# EAGLE design THB6064 (EAGLE 6.3)
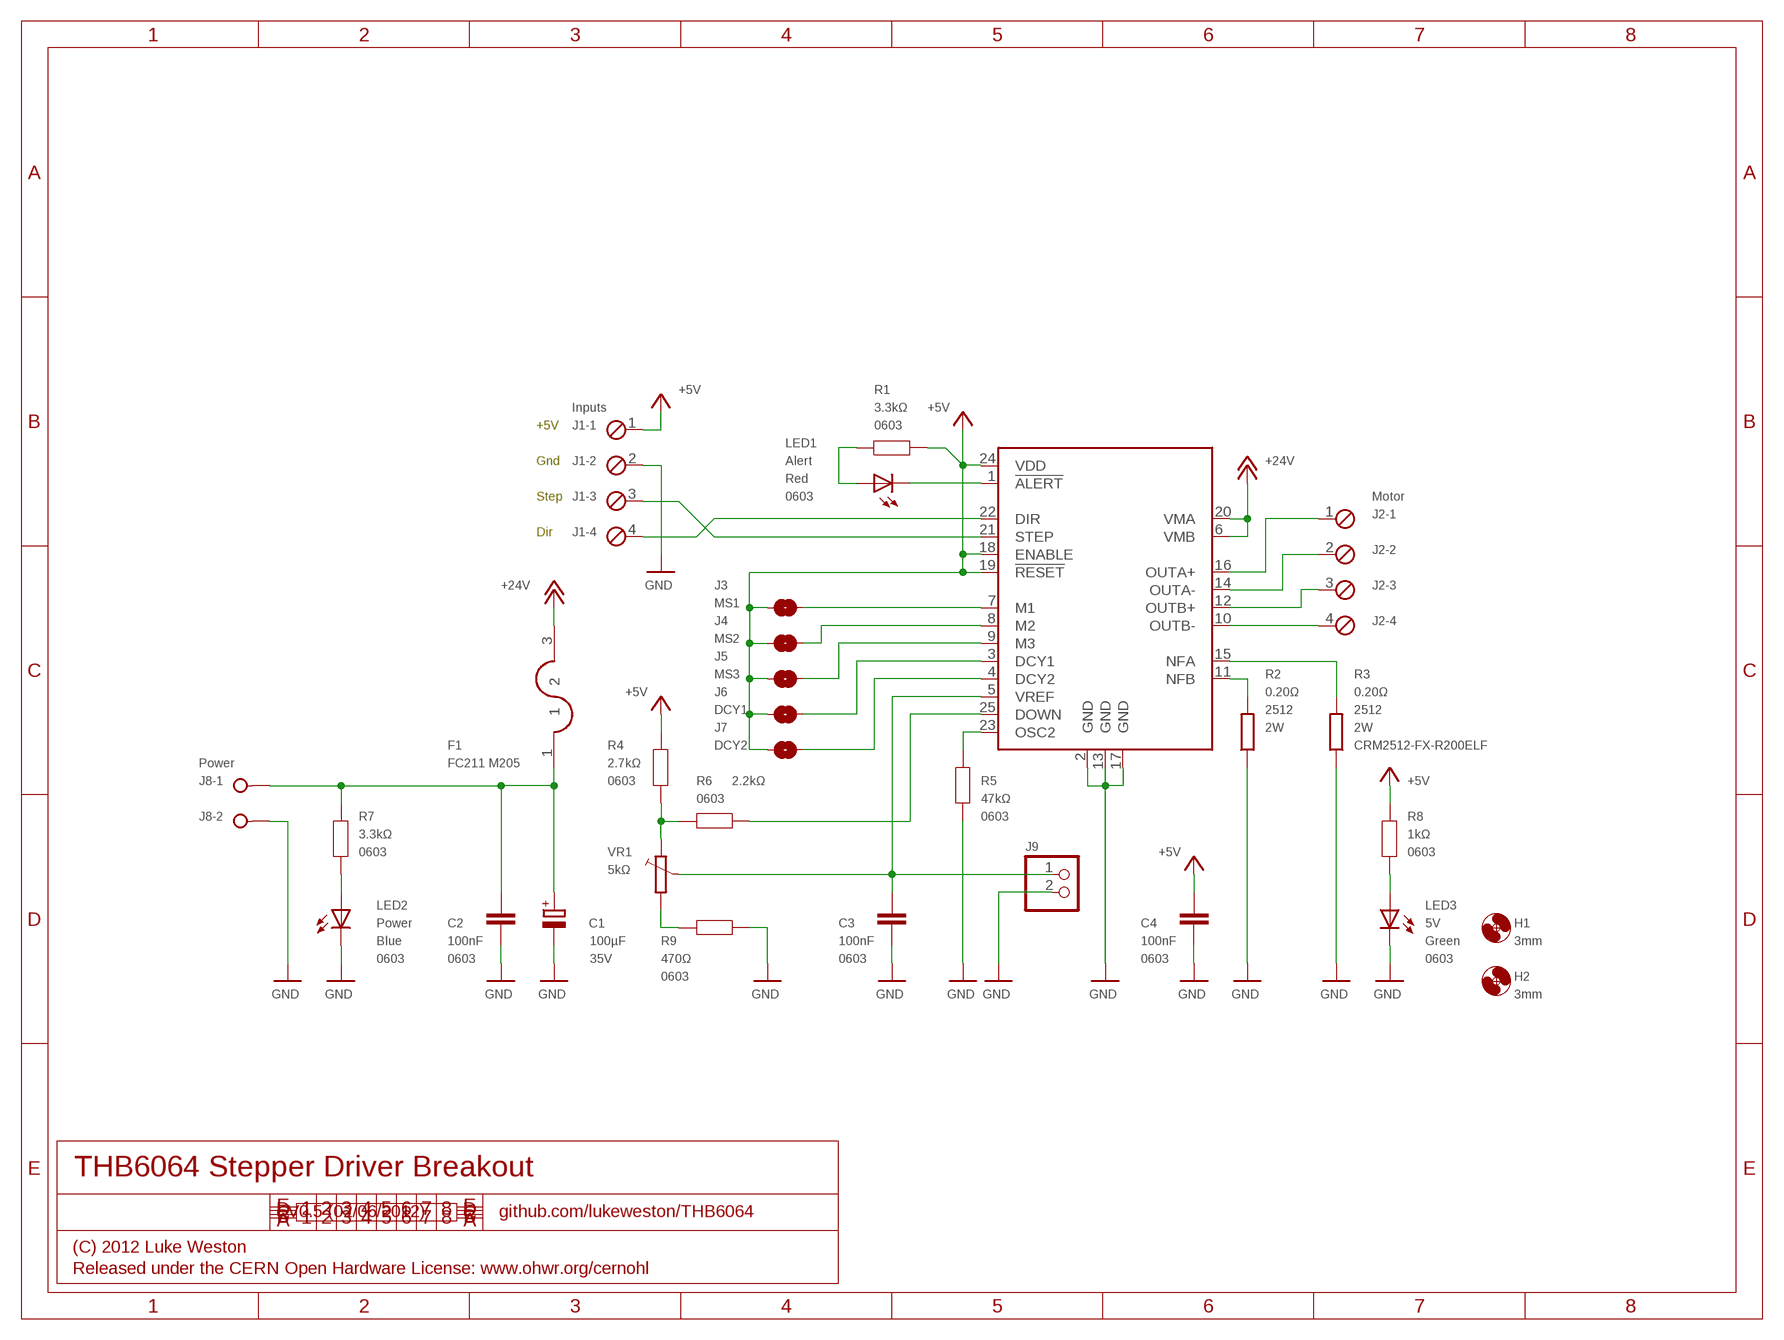
[diagram p0: schematic, sheet 1]

## Parts
C1  100µF  CPOL-EUE3.5-8  [E3,5-8]
C2  100nF  CAP0603  [0603]
C3  100nF  CAP0603  [0603]
C4  100nF  CAP0603  [0603]
F1  FC211 M205  FUSEX20MM  [FUSE_5MM]
H1  3mm  MOUNT-HOLE3.0  [3,0]
H2  3mm  MOUNT-HOLE3.0  [3,0]
IC1  THB6064  [ZIP25]
J1  Inputs  MPT4  [4POL254]
J2  Motor  MPT4  [4POL254]
J3  MS1  SJ  [SJ]
J4  MS2  SJ  [SJ]
J5  MS3  SJ  [SJ]
J6  DCY1  SJ  [SJ]
J7  DCY2  SJ  [SJ]
J8  Power  W237-02P  [W237-132]
J9  PINHD-1X2  [1X02]
LED1  Alert  LED0603  [LED-0603]
LED2  Power  LED0603  [LED-0603]
LED3  5V  LED0603  [LED-0603]
R1  3.3kΩ  RESISTOR0603  [0603]
R2  0.20Ω  R-EU_R2512  [R2512]
R3  0.20Ω  R-EU_R2512  [R2512]
R4  2.7kΩ  RESISTOR0603  [0603]
R5  47kΩ  RESISTOR0603  [0603]
R6  2.2kΩ  RESISTOR0603  [0603]
R7  3.3kΩ  RESISTOR0603  [0603]
R8  1kΩ  RESISTOR0603  [0603]
R9  470Ω  RESISTOR0603  [0603]
VR1  5kΩ  TRIM_EU-CT6  [CT6]

## Nets
+5V: C4.1 IC1.18(ENABLE) IC1.19(!RESET) IC1.24(VDD) J1.1 J3.1 J4.1 J5.1 J6.1 J7.1 R1.2 R4.2 R8.2
+12V: F1.3 IC1.6(VMB) IC1.20(VMA) ; supply symbol labelled +24V
DIR: IC1.22(DIR) J1.4
GND: C1.- C2.2 C3.2 C4.2 IC1.2(GND) IC1.13(GND) IC1.17(GND) J1.2 J8.2 J9.2 LED2.C LED3.C R2.1 R3.1 R5.1 R9.1
MA+: IC1.16(OUTA+) J2.1
MA-: IC1.14(OUTA-) J2.2
MB+: IC1.12(OUTB+) J2.3
MB-: IC1.10(OUTB-) J2.4
N$1: LED2.A R7.1
N$4: LED3.A R8.1
N$5: C1.+ C2.1 F1.1 J8.1 R7.2
N$99: C3.1 IC1.5(VREF) J9.1 VR1.S
N$100: IC1.25(DOWN) R6.1
N$101: R4.1 R6.2 VR1.E
N$102: IC1.1(!ALERT) LED1.C
N$103: LED1.A R1.1
N$104: R9.2 VR1.A
N$105: IC1.23(OSC2) R5.2
N$106: IC1.11(NFB) R2.2
N$107: IC1.15(NFA) R3.2
N$114: IC1.4(DCY2) J7.2
N$115: IC1.3(DCY1) J6.2
N$116: IC1.9(M3) J5.2
N$117: IC1.8(M2) J4.2
N$118: IC1.7(M1) J3.2
STEP: IC1.21(STEP) J1.3

## Notes on the sheet
- +5V
- Gnd
- Step
- Dir
- THB6064 Stepper Driver Breakout
- V0.5 (02/06/2012) | github.com/lukeweston/THB6064
- (C) 2012 Luke Weston
- Released under the CERN Open Hardware License: www.ohwr.org/cernohl

## Library data of the parts
C1 = rcl:CPOL-EU: POLARIZED CAPACITOR, European symbol; VOLTAGE: 35V
C2-C4 = freetronics-master-v1:CAP: Capacitor Standard 0603 ceramic capacitor, and 0.1" leaded capacitor.; PACKAGE: 0603
F1 = SparkFun:FUSE
H1 H2 = holes:MOUNT-HOLE: MOUNTING HOLE with drill center marker
IC1 = tb6560:THB6064: THB6064 Bipolar Stepper Driver IC
J1 J2 = con-phoenix-254:MPT4: PHOENIX CONNECTOR; OC_FARNELL: unknown; OC_NEWARK: unknown
J3-J7 = freetronics-luke:SJ: PCB "solder jumper". Note that there should nothing on the BOM corresponding to this "component".
J8 = con-wago-508:W237-02P: WAGO SREW CLAMP; OC_FARNELL: unknown; OC_NEWARK: unknown
J9 = pinhead:PINHD-1X2: PIN HEADER
LED1 = freetronics-master-v1:LED: LEDs Standard schematic elements and footprints for 5mm, 3mm, 1206, and 0603 sized LEDs. 5mm - Spark Fun Electronics SKU : COM-00529 (and others); COLOR: Red; PACKAGE: 0603
LED2 = freetronics-master-v1:LED: LEDs Standard schematic elements and footprints for 5mm, 3mm, 1206, and 0603 sized LEDs. 5mm - Spark Fun Electronics SKU : COM-00529 (and others); COLOR: Blue; PACKAGE: 0603
LED3 = freetronics-master-v1:LED: LEDs Standard schematic elements and footprints for 5mm, 3mm, 1206, and 0603 sized LEDs. 5mm - Spark Fun Electronics SKU : COM-00529 (and others); COLOR: Green; PACKAGE: 0603
R1 R4-R9 = freetronics-master-v1:RESISTOR: Resistor Basic schematic elements and footprints for 0603, 1206, and PTH 1/10th watt (small) resistors.; PACKAGE: 0603
R2 = rcl:R-EU_: RESISTOR, European symbol; PACKAGE: 2512; POWER: 2W
R3 = rcl:R-EU_: RESISTOR, European symbol; PACKAGE: 2512; POWER: 2W; SKU: CRM2512-FX-R200ELF
VR1 = pot:TRIM_EU-: POTENTIOMETER

## Board
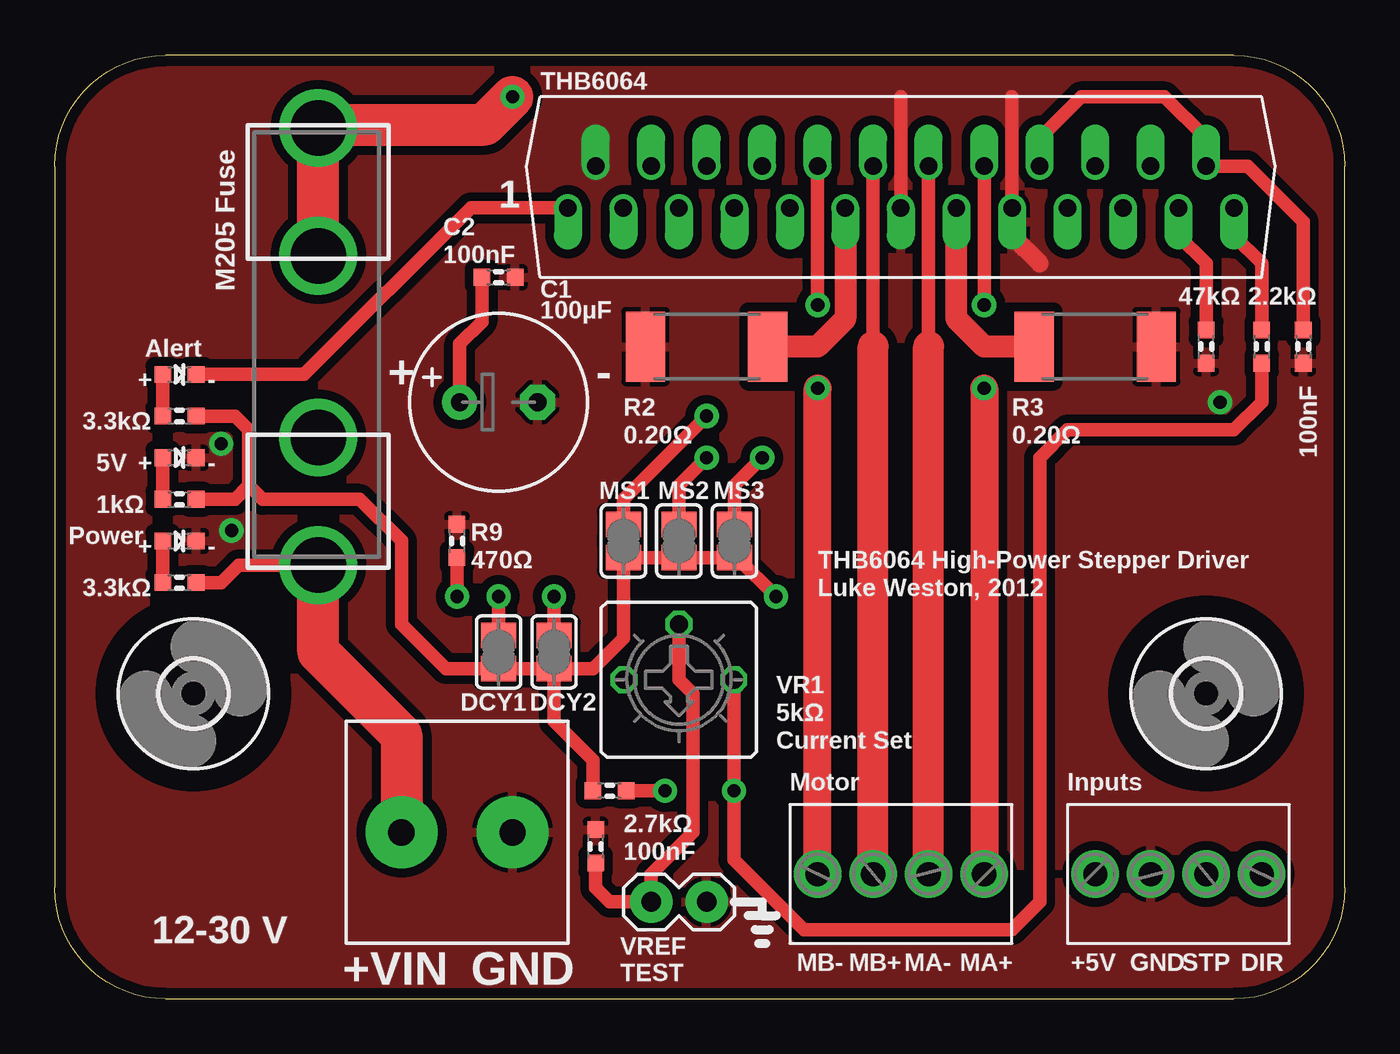
[diagram p1: board, top side]
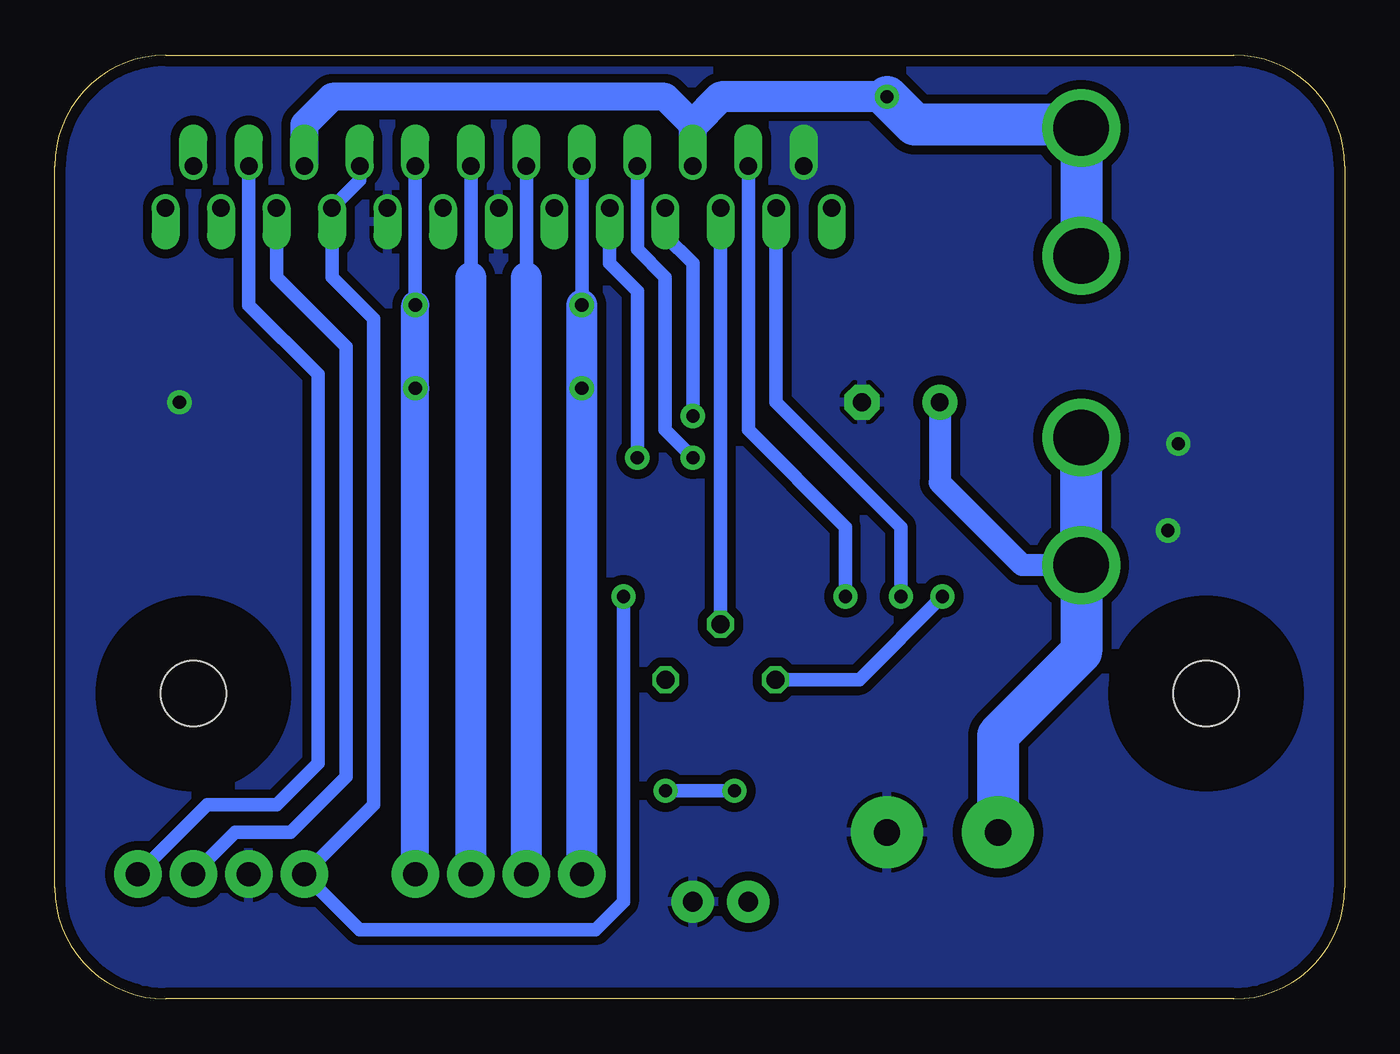
[diagram p2: board, bottom side, seen from below]

Size 59.05 x 43.18 mm. Coordinates in mm from the lower left corner, seen from the top.
Outline: 5.08,0 53.97,0 arc90 59.05,5.08 59.05,38.1 arc90 53.97,43.18 5.08,43.18 arc90 0,38.1 0,5.08 arc90 5.08,0
Copper layers (1*16): Top 0.035mm / dielectric 1.5mm / Bottom 0.035mm
Design rules "PCBCart-Standard": minimum track width 8mil, minimum drill 0.4mm, track to track 8mil, track to pad 8mil, pad to pad 8mil, via to via 8mil, smd to smd 8mil, copper to edge 20mil, drill to drill 8mil, minimum pad ring 8mil, minimum via ring 10mil, stop-mask expansion 3mil, vias tented up to drill 0mil, thermal gap 8mil

### Footprints (pad centres in the part's own frame; a part is rotated, then mirrored left to right if it is on the bottom)
E3,5-8 = drill 0.813 pad 1.6: + -1.778,0 | drill 0.813 pad 1.6 octagon: - 1.778,0
0603 = smd 0.762 x 0.762: 1 -0.762,0; 2 0.762,0
FUSE_5MM = drill 2.54 pad 3.556: 1 0,-10; 2 0,-4.158; 3 0,4.158; 4 0,10
3,0 = hole 3: 0,0
ZIP25 = drill 0.8 pad 1.27 offset: 1 -15.24,0; 2 -13.97,1.905; 3 -12.7,0; 4 -11.43,1.905; 5 -10.16,0; 6 -8.89,1.905; 7 -7.62,0; 8 -6.35,1.905; 9 -5.08,0; 10 -3.81,1.905; 11 -2.54,0; 12 -1.27,1.905; 13 0,0; 14 1.27,1.905; 15 2.54,0; 16 3.81,1.905; 17 5.08,0; 18 6.35,1.905; 19 7.62,0; 20 8.89,1.905; 21 10.16,0; 22 11.43,1.905; 23 12.7,0; 24 13.97,1.905; 25 15.24,0
4POL254 = drill 1.1 pad 2.184: 1 -3.81,0; 2 -1.27,0; 3 1.27,0; 4 3.81,0
SJ = smd 1.168 x 1.6: 1 -0.762,0; 2 0.762,0
W237-132 = drill 1.2 pad 3.302: 1 -2.54,-0.635; 2 2.54,-0.635
1X02 = drill 0.9 pad 1.93: 1 -1.27,0; 2 1.27,0
LED-0603 = smd 0.762 x 0.762: A -0.762,0; C 0.762,0
R2512 = smd 1.8 x 3.2: 1 -2.8,0; 2 2.8,0
CT6 = drill 0.813 octagon: A 2.515,0; E -2.515,0; S 0,-2.54

### Placement (x,y rotation side)
C1  20.32,27.3 0 top
C2  20.32,33.02 0 top
C3  24.77,6.99 90 top
C4  57.15,29.84 270 top
F1  12.07,29.84 0 top
H1  52.7,13.97 0 top
H2  6.35,13.97 0 top
IC1  38.73,36.2 0 top
J1  51.43,5.71 0 top
J2  38.73,5.71 180 top
J3  26.04,20.96 90 top
J4  28.57,20.96 90 top
J5  31.11,20.96 90 top
J6  20.32,15.88 90 top
J7  22.86,15.88 90 top
J8  18.41,8.26 0 top
J9  28.57,4.45 0 top
LED1  5.71,28.57 0 top
LED2  5.71,20.96 0 top
LED3  5.71,24.77 0 top
R1  5.71,26.67 0 top
R2  29.84,29.84 0 top
R3  47.62,29.84 180 top
R4  25.4,9.53 180 top
R5  52.7,29.84 90 top
R6  55.24,29.84 270 top
R7  5.71,19.05 0 top
R8  5.71,22.86 0 top
R9  18.41,20.96 270 top
VR1  28.57,14.61 180 top

### Tracks (layer width: path | path; a pad name or v marks a point on that pad's centre or on a via)
+5V  (via drill 0.6)
  Top 0.61: IC1.18 45.08,39.37 46.99,41.27 50.8,41.27 52.7,39.37 IC1.24 54.61,38.1 57.15,35.56 C4.1 | 22.99,15.11 J7.1 J6.1 17.91,15.11 15.88,17.14 15.88,20.96 13.97,22.86 9.53,22.86 8.89,23.5 | v33.02,18.41 31.24,20.19 J5.1 J4.1 J3.1 26.04,16.51 24.64,15.11 22.99,15.11 | R1.2 8.26,26.67 8.89,26.04 8.89,23.5 | R8.2 8.26,22.86 8.89,23.5 | 22.99,15.11 22.86,15.24 22.86,12.7 24.64,10.92 R4.2
  Bottom 0.61: IC1.18 45.08,37.46 IC1.19 46.35,33.02 44.45,31.11 44.45,8.89 J1.1 45.08,3.18 34.29,3.18 33.02,4.45 v33.02,18.41
+12V  (via drill 0.6)
  Top 1.93: v20.96,41.27 19.68,40 12.07,40 12.07,33.65
  Bottom 1.27: IC1.6 29.84,40 31.11,41.27 46.35,41.27 47.62,40 IC1.20
  Bottom 1.422: v20.96,41.27 28.57,41.27 29.84,40 | 12.07,40 F1.3
  Bottom 1.93: v20.96,41.27 19.68,40 12.07,40 12.07,33.65
DIR
  Bottom 0.61: IC1.22 50.16,31.75 46.99,28.57 46.99,10.79 48.89,8.89 52.07,8.89 J1.4
GND  (via drill 0.6)
  Top 0.61: 38.73,41.27 IC1.13 | IC1.17 43.81,41.27
  Top 0.813: IC1.17 43.81,34.92 45.08,33.65
  other vias: 8.1,21.43 7.62,25.4 53.34,27.3
  pour Top (isolate 0.406): -1.27,44.45 60.32,44.45 60.32,-1.27 -1.27,-1.27
  pour Bottom (isolate 0.406): -1.27,44.45 60.32,44.45 60.32,-1.27 -1.27,-1.27
MA+  (via drill 0.6)
  Top 0.61: IC1.16 v42.54,31.75
  Top 1.27: v42.54,27.94 J2.1
  Bottom 0.61: v42.54,31.75 IC1.16
  Bottom 1.27: J2.1 v42.54,27.94 v42.54,31.75
MA-
  Top 0.61: 40,29.84 IC1.14
  Top 1.422: J2.2 40,29.84
  Bottom 0.61: 40,33.02 IC1.14
  Bottom 1.422: J2.2 40,33.02
MB+
  Top 0.61: 37.46,29.84 IC1.12
  Top 1.422: J2.3 37.46,29.84
  Bottom 0.61: 37.46,33.02 IC1.12
  Bottom 1.422: J2.3 37.46,33.02
MB-  (via drill 0.6)
  Top 0.61: IC1.10 v34.92,31.75
  Top 1.27: J2.4 v34.92,27.94
  Bottom 0.61: v34.92,31.75 IC1.10
  Bottom 1.422: J2.4 v34.92,27.94 v34.92,31.75
N$1
  Top 0.61: LED2.A R7.1
N$4
  Top 0.61: LED3.A R8.1
N$5
  Top 0.61: R7.2 7.62,19.05 8.42,19.84 F1.1 | C2.1 19.56,30.99 18.54,29.97 C1.+
  Top 1.93: J8.1 15.88,12.07 12.07,15.88 12.07,19.68
  Bottom 1.016: F1.1 14.77,19.84 18.54,23.62 C1.+
  Bottom 1.93: J8.1 15.88,12.07 12.07,15.88 F1.1 12.07,26.04
N$99
  Top 0.61: VR1.S 28.57,14.61 29.21,13.97 29.21,7.62 27.3,5.71 J9.1 25.4,4.45 24.77,5.08 C3.1
  Bottom 0.61: VR1.S IC1.5
N$100
  Top 0.61: R6.1 55.24,33.65 53.97,34.92 IC1.25
N$101  (via drill 0.6)
  Top 0.61: VR1.E v31.09,9.53 31.09,6.38 34.29,3.18 43.81,3.18 45.08,4.45 45.08,24.77 46.35,26.04 53.97,26.04 55.24,27.3 R6.2 | R4.1 v27.94,9.53
  Bottom 0.61: v27.94,9.53 v31.09,9.53
N$102
  Top 0.61: IC1.1 19.05,36.2 11.43,28.57 LED1.C
N$103
  Top 0.61: LED1.A R1.1
N$104  (via drill 0.6)
  Top 0.61: R9.2 v18.41,18.41
  Bottom 0.61: VR1.A 22.23,14.61 v18.41,18.41
N$105
  Top 0.61: R5.2 52.7,33.65 51.43,34.92 IC1.23
N$106
  Top 1.016: IC1.11 36.2,31.11 34.92,29.84 R2.2
N$107
  Top 1.016: R3.2 42.54,29.84 41.27,31.11 IC1.15
N$114  (via drill 0.6)
  Top 0.61: v22.86,18.41 J7.2
  Bottom 0.61: IC1.4 27.3,26.04 22.86,21.59 v22.86,18.41
N$115  (via drill 0.6)
  Top 0.61: v20.32,18.41 J6.2
  Bottom 0.61: IC1.3 26.04,27.3 20.32,21.59 v20.32,18.41
N$116  (via drill 0.6)
  Top 0.61: J5.2 31.11,23.5 v32.38,24.77
  Bottom 0.61: v32.38,24.77 32.38,32.38 33.65,33.65 IC1.9
N$117  (via drill 0.6)
  Top 0.61: v29.84,24.77 28.57,23.5 J4.2
  Bottom 0.61: IC1.8 32.38,34.29 31.11,33.02 31.11,26.04 v29.84,24.77
N$118  (via drill 0.6)
  Top 0.61: J3.2 26.04,22.86 v29.84,26.67
  Bottom 0.61: v29.84,26.67 29.84,33.65 31.11,34.92 IC1.7
STEP
  Bottom 0.61: IC1.21 48.89,33.02 45.72,29.84 45.72,10.16 48.26,7.62 50.8,7.62 J1.3

### Text on the board
tPlace: THB6064 | 1 | M205 Fuse | + | - | + | - | + | - | MS1 | MS2 | MS3 | + | - | THB6064 High-Power Stepper Driver | Luke Weston, 2012 | DCY1 | DCY2 | Current Set | 12-30 V | MB- | MB+ | MA- | MA+ | +5V | GND | STP | DIR | +VIN | GND | VREF / TEST